# EAGLE design Robot_Psoc_Caras_2 (EAGLE 7.5.0)
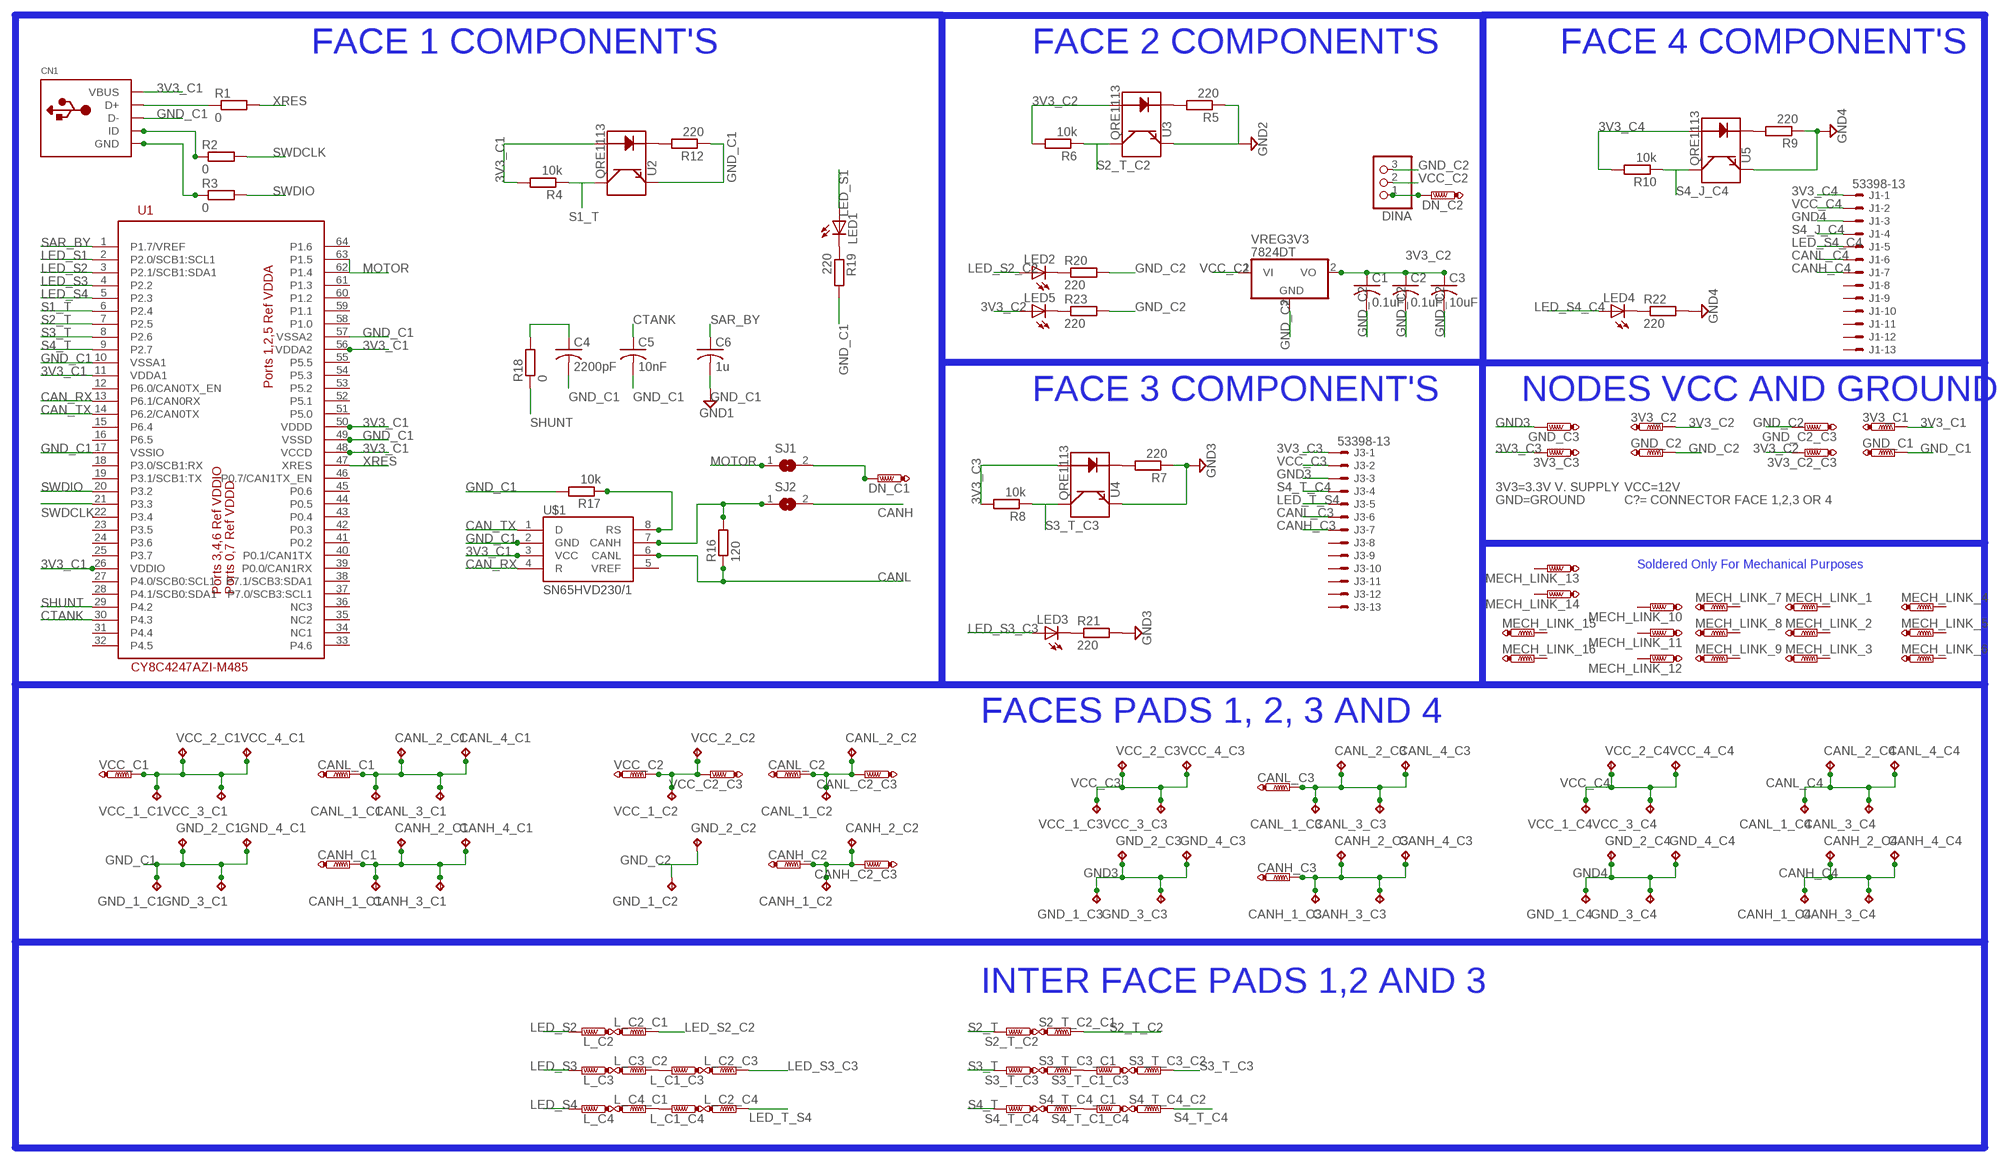
[diagram p0: schematic, sheet 1]

## Parts
3V3_C1  PTR1TP11R  [TP11R]
3V3_C2  PTR1TP11R  [TP11R]
3V3_C2_C3  PTR1TP11R  [TP11R]
3V3_C3  PTR1TP11R  [TP11R]
C1  0.1uF  C-USC0805  [C0805]
C2  0.1uF  C-USC0805  [C0805]
C3  10uF  C-USC4532  [C4532]
C4  2200pF  C-USC0805  [C0805]
C5  10nF  C-USC0805  [C0805]
C6  1u  C-USC0805  [C0805]
CANH_1_C1  TPB2,54  [B2,54]
CANH_1_C2  TPB2,54  [B2,54]
CANH_1_C3  TPB2,54  [B2,54]
CANH_1_C4  TPB2,54  [B2,54]
CANH_2_C1  TPB2,54  [B2,54]
CANH_2_C2  TPB2,54  [B2,54]
CANH_2_C3  TPB2,54  [B2,54]
CANH_2_C4  TPB2,54  [B2,54]
CANH_3_C1  TPB2,54  [B2,54]
CANH_3_C3  TPB2,54  [B2,54]
CANH_3_C4  TPB2,54  [B2,54]
CANH_4_C1  TPB2,54  [B2,54]
CANH_4_C3  TPB2,54  [B2,54]
CANH_4_C4  TPB2,54  [B2,54]
CANH_C1  PTR1TP11R  [TP11R]
CANH_C2  PTR1TP11R  [TP11R]
CANH_C2_C3  PTR1TP11R  [TP11R]
CANH_C3  PTR1TP11R  [TP11R]
CANL_1_C1  TPB2,54  [B2,54]
CANL_1_C2  TPB2,54  [B2,54]
CANL_1_C3  TPB2,54  [B2,54]
CANL_1_C4  TPB2,54  [B2,54]
CANL_2_C1  TPB2,54  [B2,54]
CANL_2_C2  TPB2,54  [B2,54]
CANL_2_C3  TPB2,54  [B2,54]
CANL_2_C4  TPB2,54  [B2,54]
CANL_3_C1  TPB2,54  [B2,54]
CANL_3_C3  TPB2,54  [B2,54]
CANL_3_C4  TPB2,54  [B2,54]
CANL_4_C1  TPB2,54  [B2,54]
CANL_4_C3  TPB2,54  [B2,54]
CANL_4_C4  TPB2,54  [B2,54]
CANL_C1  PTR1TP11R  [TP11R]
CANL_C2  PTR1TP11R  [TP11R]
CANL_C2_C3  PTR1TP11R  [TP11R]
CANL_C3  PTR1TP11R  [TP11R]
CN1  USBMINIB  [USB-MINIB]
DINA  PINHD-1X3  [1X03]
DN_C1  PTR1TP11R  [TP11R]
DN_C2  PTR1TP11R  [TP11R]
GND_1_C1  TPB2,54  [B2,54]
GND_1_C2  TPB2,54  [B2,54]
GND_1_C3  TPB2,54  [B2,54]
GND_1_C4  TPB2,54  [B2,54]
GND_2_C1  TPB2,54  [B2,54]
GND_2_C2  TPB2,54  [B2,54]
GND_2_C3  TPB2,54  [B2,54]
GND_2_C4  TPB2,54  [B2,54]
GND_3_C1  TPB2,54  [B2,54]
GND_3_C3  TPB2,54  [B2,54]
GND_3_C4  TPB2,54  [B2,54]
GND_4_C1  TPB2,54  [B2,54]
GND_4_C3  TPB2,54  [B2,54]
GND_4_C4  TPB2,54  [B2,54]
GND_C1  PTR1TP11R  [TP11R]
GND_C2  PTR1TP11R  [TP11R]
GND_C2_C3  PTR1TP11R  [TP11R]
GND_C3  PTR1TP11R  [TP11R]
J1  53398-13  [53398-13]
J3  53398-13  [53398-13]
L_C1_C3  PTR1TP11R  [TP11R]
L_C1_C4  PTR1TP11R  [TP11R]
L_C2  PTR1TP11R  [TP11R]
L_C2_C1  PTR1TP11R  [TP11R]
L_C2_C3  PTR1TP11R  [TP11R]
L_C2_C4  PTR1TP11R  [TP11R]
L_C3  PTR1TP11R  [TP11R]
L_C3_C2  PTR1TP11R  [TP11R]
L_C4  PTR1TP11R  [TP11R]
L_C4_C1  PTR1TP11R  [TP11R]
LED1  LEDCHIPLED_0805  [CHIPLED_0805]
LED2  LEDCHIPLED_0805  [CHIPLED_0805]
LED3  LEDCHIPLED_0805  [CHIPLED_0805]
LED4  LEDCHIPLED_0805  [CHIPLED_0805]
LED5  LEDCHIPLED_0805  [CHIPLED_0805]
MECH_LINK_1  PTR1TP11R  [TP11R]
MECH_LINK_2  PTR1TP11R  [TP11R]
MECH_LINK_3  PTR1TP11R  [TP11R]
MECH_LINK_4  PTR1TP11R  [TP11R]
MECH_LINK_5  PTR1TP11R  [TP11R]
MECH_LINK_6  PTR1TP11R  [TP11R]
MECH_LINK_7  PTR1TP11R  [TP11R]
MECH_LINK_8  PTR1TP11R  [TP11R]
MECH_LINK_9  PTR1TP11R  [TP11R]
MECH_LINK_10  PTR1TP11R  [TP11R]
MECH_LINK_11  PTR1TP11R  [TP11R]
MECH_LINK_12  PTR1TP11R  [TP11R]
MECH_LINK_13  PTR1TP11R  [TP11R]
MECH_LINK_14  PTR1TP11R  [TP11R]
MECH_LINK_15  PTR1TP11R  [TP11R]
MECH_LINK_16  PTR1TP11R  [TP11R]
R1  0  R-EU_R0805  [R0805]
R2  0  R-EU_R0805  [R0805]
R3  0  R-EU_R0805  [R0805]
R4  10k  R-EU_R0805  [R0805]
R5  220  R-EU_R0805  [R0805]
R6  10k  R-EU_R0805  [R0805]
R7  220  R-EU_R0805  [R0805]
R8  10k  R-EU_R0805  [R0805]
R9  220  R-EU_R0805  [R0805]
R10  10k  R-EU_R0805  [R0805]
R12  220  R-EU_R0805  [R0805]
R16  120  R-EU_R0805  [R0805]
R17  10k  R-EU_R0805  [R0805]
R18  0  R-EU_R0805  [R0805]
R19  220  R-EU_R0805  [R0805]
R20  220  R-EU_R0805  [R0805]
R21  220  R-EU_R0805  [R0805]
R22  220  R-EU_R0805  [R0805]
R23  220  R-EU_R0805  [R0805]
S2_T_C2  PTR1TP11R  [TP11R]
S2_T_C2_C1  PTR1TP11R  [TP11R]
S3_T_C1_C3  PTR1TP11R  [TP11R]
S3_T_C3  PTR1TP11R  [TP11R]
S3_T_C3_C1  PTR1TP11R  [TP11R]
S3_T_C3_C2  PTR1TP11R  [TP11R]
S4_T_C1_C4  PTR1TP11R  [TP11R]
S4_T_C4  PTR1TP11R  [TP11R]
S4_T_C4_C1  PTR1TP11R  [TP11R]
S4_T_C4_C2  PTR1TP11R  [TP11R]
SJ1  SJ  [SJ]
SJ2  SJ  [SJ]
U1  CY8C4247AZI-M485  [TQFP64-10X10]
U2  QRE1113  [QRE1113]
U3  QRE1113  [QRE1113]
U4  QRE1113  [QRE1113]
U5  QRE1113  [QRE1113]
U$1  SN65HVD230/1  [SO8]
VCC_1_C1  TPB2,54  [B2,54]
VCC_1_C2  TPB2,54  [B2,54]
VCC_1_C3  TPB2,54  [B2,54]
VCC_1_C4  TPB2,54  [B2,54]
VCC_2_C1  TPB2,54  [B2,54]
VCC_2_C2  TPB2,54  [B2,54]
VCC_2_C3  TPB2,54  [B2,54]
VCC_2_C4  TPB2,54  [B2,54]
VCC_3_C1  TPB2,54  [B2,54]
VCC_3_C3  TPB2,54  [B2,54]
VCC_3_C4  TPB2,54  [B2,54]
VCC_4_C1  TPB2,54  [B2,54]
VCC_4_C3  TPB2,54  [B2,54]
VCC_4_C4  TPB2,54  [B2,54]
VCC_C1  PTR1TP11R  [TP11R]
VCC_C2  PTR1TP11R  [TP11R]
VCC_C2_C3  PTR1TP11R  [TP11R]
VREG3V3  7824DT  [TO252]

## Nets
3V3_C1: 3V3_C1.TP CN1.VBUS R4.2 U1.11(VDDA1) U1.26(VDDIO) U1.48(VCCD) U1.50(VDDD) U1.56(VDDA2) U2.1(A) U$1.3(VCC)
3V3_C2: 3V3_C2.TP 3V3_C2_C3.TP C1.1 C2.1 C3.1 LED5.A R6.2 U3.1(A) VREG3V3.2(VO)
3V3_C3: 3V3_C3.TP J3.1 R8.2 U4.1(A)
3V3_C4: J1.1 R10.2 U5.1(A)
CAN_RX: U1.13(P6.1/CAN0RX) U$1.4(R)
CAN_TX: U1.14(P6.2/CAN0TX) U$1.1(D)
CANH: CANH_1_C1.TP CANH_2_C1.TP CANH_3_C1.TP CANH_4_C1.TP CANH_C1.TP SJ2.2
CANH_C3: CANH_1_C3.TP CANH_2_C3.TP CANH_3_C3.TP CANH_4_C3.TP CANH_C3.TP J3.7
CANH_C4: CANH_1_C4.TP CANH_2_C4.TP CANH_3_C4.TP CANH_4_C4.TP J1.7
CANL: CANL_1_C1.TP CANL_2_C1.TP CANL_3_C1.TP CANL_4_C1.TP CANL_C1.TP R16.1 U$1.6(CANL)
CANL_C3: CANL_1_C3.TP CANL_2_C3.TP CANL_3_C3.TP CANL_4_C3.TP CANL_C3.TP J3.6
CANL_C4: CANL_1_C4.TP CANL_2_C4.TP CANL_3_C4.TP CANL_4_C4.TP J1.6
CTANK: C5.1 U1.30(P4.3)
GND3: GND_1_C3.TP GND_2_C3.TP GND_3_C3.TP GND_4_C3.TP GND_C3.TP J3.3 R7.1 R21.2 U4.4(E)
GND4: GND_1_C4.TP GND_2_C4.TP GND_3_C4.TP GND_4_C4.TP J1.3 R9.1 R22.2 U5.4(E)
GND_C1: C4.2 C5.2 C6.2 CN1.D- GND_1_C1.TP GND_2_C1.TP GND_3_C1.TP GND_4_C1.TP GND_C1.TP R12.1 R17.2 R19.2 U1.10(VSSA1) U1.17(VSSIO) U1.49(VSSD) U1.57(VSSA2) U2.4(E) U$1.2(GND) ; supply symbol labelled GND1
GND_C2: C1.2 C2.2 C3.2 DINA.3 GND_1_C2.TP GND_2_C2.TP GND_C2.TP GND_C2_C3.TP R5.1 R20.2 R23.2 U3.4(E) VREG3V3.3(GND) ; supply symbol labelled GND2
LED_S1: LED1.A U1.2(P2.0/SCB1:SCL1)
LED_S2: L_C2.TP U1.3(P2.1/SCB1:SDA1)
LED_S2_C2: L_C2_C1.TP LED2.A
LED_S3: L_C3.TP U1.4(P2.2)
LED_S3_C3: L_C2_C3.TP LED3.A
LED_S4: L_C4.TP U1.5(P2.3)
LED_S4_C4: J1.5 LED4.A
LED_T_S4: J3.5 L_C2_C4.TP
MOTOR: SJ1.1 U1.62(P1.4) U1.63(P1.5)
N$1: CN1.D+ R1.1
N$2: CN1.ID R2.1
N$3: CN1.GND R3.1
N$5: R16.2 SJ2.1 U$1.7(CANH)
N$6: R5.2 U3.2(K)
N$7: CANH_1_C2.TP CANH_2_C2.TP CANH_C2.TP CANH_C2_C3.TP
N$8: R7.2 U4.2(K)
N$9: R17.1 U$1.8(RS)
N$10: R9.2 U5.2(K)
N$11: C4.1 R18.2
N$13: DN_C1.TP SJ1.2
N$14: LED1.C R19.1
N$15: LED2.C R20.1
N$16: LED3.C R21.1
N$17: LED4.C R22.1
N$18: LED5.C R23.1
N$19: DINA.1 DN_C2.TP
N$20: L_C1_C4.TP L_C4_C1.TP
N$21: R12.2 U2.2(K)
N$22: L_C1_C3.TP L_C3_C2.TP
N$26: S3_T_C1_C3.TP S3_T_C3_C1.TP
N$27: S4_T_C1_C4.TP S4_T_C4_C1.TP
N$29: VCC_1_C1.TP VCC_2_C1.TP VCC_3_C1.TP VCC_4_C1.TP VCC_C1.TP
N$32: CANL_1_C2.TP CANL_2_C2.TP CANL_C2.TP CANL_C2_C3.TP
S1_T: R4.1 U1.6(P2.4) U2.3(C)
S2_T: S2_T_C2.TP U1.7(P2.5)
S2_T_C2: R6.1 S2_T_C2_C1.TP U3.3(C)
S3_T: S3_T_C3.TP U1.8(P2.6)
S3_T_C3: R8.1 S3_T_C3_C2.TP U4.3(C)
S4_J_C4: J1.4 R10.1 U5.3(C)
S4_T: S4_T_C4.TP U1.9(P2.7)
S4_T_C4: J3.4 S4_T_C4_C2.TP
SAR_BY: C6.1 U1.1(P1.7/VREF)
SHUNT: R18.1 U1.29(P4.2)
SWDCLK: R2.2 U1.21(P3.3)
SWDIO: R3.2 U1.20(P3.2)
VCC_C2: DINA.2 VCC_1_C2.TP VCC_2_C2.TP VCC_C2.TP VCC_C2_C3.TP VREG3V3.1(VI)
VCC_C3: J3.2 VCC_1_C3.TP VCC_2_C3.TP VCC_3_C3.TP VCC_4_C3.TP
VCC_C4: J1.2 VCC_1_C4.TP VCC_2_C4.TP VCC_3_C4.TP VCC_4_C4.TP
XRES: R1.2 U1.47(XRES)
Unconnected: J1.8 J1.9 J1.10 J1.11 J1.12 J1.13 J3.8 J3.9 J3.10 J3.11 J3.12 J3.13 MECH_LINK_1.TP MECH_LINK_2.TP MECH_LINK_3.TP MECH_LINK_4.TP MECH_LINK_5.TP MECH_LINK_6.TP MECH_LINK_7.TP MECH_LINK_8.TP MECH_LINK_9.TP MECH_LINK_10.TP MECH_LINK_11.TP MECH_LINK_12.TP MECH_LINK_13.TP MECH_LINK_14.TP MECH_LINK_15.TP MECH_LINK_16.TP U1.12(P6.0/CAN0TX_EN) U1.15(P6.4) U1.16(P6.5) U1.18(P3.0/SCB1:RX) U1.19(P3.1/SCB1:TX) U1.22(P3.4) U1.23(P3.5) U1.24(P3.6) U1.25(P3.7) U1.27(P4.0/SCB0:SCL1) U1.28(P4.1/SCB0:SDA1) U1.31(P4.4) U1.32(P4.5) U1.33(P4.6) U1.34(NC1) U1.35(NC2) U1.36(NC3) U1.37(P7.0/SCB3:SCL1) U1.38(P7.1/SCB3:SDA1) U1.39(P0.0/CAN1RX) U1.40(P0.1/CAN1TX) U1.41(P0.2) U1.42(P0.3) U1.43(P0.4) U1.44(P0.5) U1.45(P0.6) U1.46(P0.7/CAN1TX_EN) U1.51(P5.0) U1.52(P5.1) U1.53(P5.2) U1.54(P5.3) U1.55(P5.5) U1.58(P1.0) U1.59(P1.1) U1.60(P1.2) U1.61(P1.3) U1.64(P1.6) U$1.5(VREF)

## Notes on the sheet
- FACE 1 COMPONENT'S | FACE 2 COMPONENT'S | FACE 4 COMPONENT'S
- FACE 3 COMPONENT'S | NODES VCC AND GROUND
- 3V3=3.3V V. SUPPLY | VCC=12V
- GND=GROUND | C?= CONNECTOR FACE 1,2,3 OR 4
- Soldered Only For Mechanical Purposes
- FACES PADS 1, 2, 3 AND 4
- INTER FACE PADS 1,2 AND 3

## Library data of the parts
3V3_C1 3V3_C2 3V3_C2_C3 3V3_C3 CANH_C1 CANH_C2 CANH_C2_C3 CANH_C3 CANL_C1 CANL_C2 CANL_C2_C3 CANL_C3 DN_C1 DN_C2 GND_C1 GND_C2 GND_C2_C3 GND_C3 L_C1_C3 L_C1_C4 L_C2 L_C2_C1 L_C2_C3 L_C2_C4 L_C3 L_C3_C2 L_C4 L_C4_C1 MECH_LINK_1-MECH_LINK_16 S2_T_C2 S2_T_C2_C1 S3_T_C1_C3 S3_T_C3 S3_T_C3_C1 S3_T_C3_C2 S4_T_C1_C4 S4_T_C4 S4_T_C4_C1 S4_T_C4_C2 VCC_C1 VCC_C2 VCC_C2_C3 = testpad:PTR1: TEST PIN
C1-C6 = rcl:C-US: CAPACITOR, American symbol
CANH_1_C1-CANH_1_C4 CANH_2_C1-CANH_2_C4 CANH_3_C1 CANH_3_C3 CANH_3_C4 CANH_4_C1 CANH_4_C3 CANH_4_C4 CANL_1_C1-CANL_1_C4 CANL_2_C1-CANL_2_C4 CANL_3_C1 CANL_3_C3 CANL_3_C4 CANL_4_C1 CANL_4_C3 CANL_4_C4 GND_1_C1-GND_1_C4 GND_2_C1-GND_2_C4 GND_3_C1 GND_3_C3 GND_3_C4 GND_4_C1 GND_4_C3 GND_4_C4 VCC_1_C1-VCC_1_C4 VCC_2_C1-VCC_2_C4 VCC_3_C1 VCC_3_C3 VCC_3_C4 VCC_4_C1 VCC_4_C3 VCC_4_C4 = testpad:TP: Test pad
CN1 = adafruit:USB: USB Connectors USBMINIB - Surface Mount Female Mini-B USB Connector 4UConnector: 06564 By microbuilder.eu Thru-hole RA Female Mini-B USB Connector 4UConnector: 18732 By ladyada.net
DINA = pinhead:PINHD-1X3: PIN HEADER
J1 J3 = con-molex:53?-13: CONNECTOR wire to board 1.25 mm (.049 inch) pitch header; OC_FARNELL: unknown; OC_NEWARK: unknown
LED1-LED5 = adafruit:LED: LED OSRAM: - CHIPLED LG R971, LG N971, LY N971, LG Q971, LY Q971, LO R971, LY R971 LH N974, LH R974 LS Q976, LO Q976, LY Q976 LO Q996 - Hyper CHIPLED LW Q18S LB Q993, LB Q99A, LB R99A - SideLED LS A670, LO A670, LY A670, LG A670, LP A670 LB A673, LV A673, LT A673, LW A673 LH A674 LY A675 LS A676, LA A676, LO A676, LY A676, LW A676 LS A679, LY A679, LG A679 - Hyper Micro SIDELED® LS Y876, LA Y876, LO Y876, LY Y876 LT Y87S - SmartLED LW L88C, LW L88S LB L89C, LB L89S, LG L890 LS L89K, LO L89K, LY L89K LS L896, LA L896, LO L896, LY L896 - TOPLED LS T670, LO T670, LY T670, LG T670, LP T670 LSG T670, LSP T670, LSY T670, LOP T670, LYG T670 LG T671, LOG T671, LSG T671 LB T673, LV T673, LT T673, LW T673 LH T674 LS T676, LA T676, LO T676, LY T676, LB T676, LH T676, LSB T676, LW T676 LB T67C, LV T67C, LT T67C, LS T67K, LO T67K, LY T67K, LW E67C LS E67B, LA E67B, LO E67B, LY E67B, LB E67C, LV E67C, LT E67C LW T67C LS T679, LY T679, LG T679 LS T770, LO T770, LY T770, LG T770, LP T770 LB T773, LV T773, LT T773, LW T773 LH T774 LS E675, LA E675, LY E675, LS T675 LS T776, LA T776, LO T776, LY T776, LB T776 LHGB T686 LT T68C, LB T68C - Hyper Mini TOPLED® LB M676 - Mini TOPLED Santana® LG M470 LS M47K, LO M47K, LY M47K Source: http://www.osram.convergy.de/
R1-R10 R12 R16-R23 = rcl:R-EU_: RESISTOR, European symbol
SJ1 SJ2 = jumper:SJ: SMD solder JUMPER
U1 = CypressPSoC:CY8C4247AZI-M485
U2-U5 = SparkFun-Sensors:QRE1113: Reflective object sensor; PROD_ID: IC-09357
U$1 = texas_instruments:SN65HVD230/1
VREG3V3 = adafruit:78*: Positive VOLTAGE REGULATOR Added bigger pads to the TO-92 package

## Board
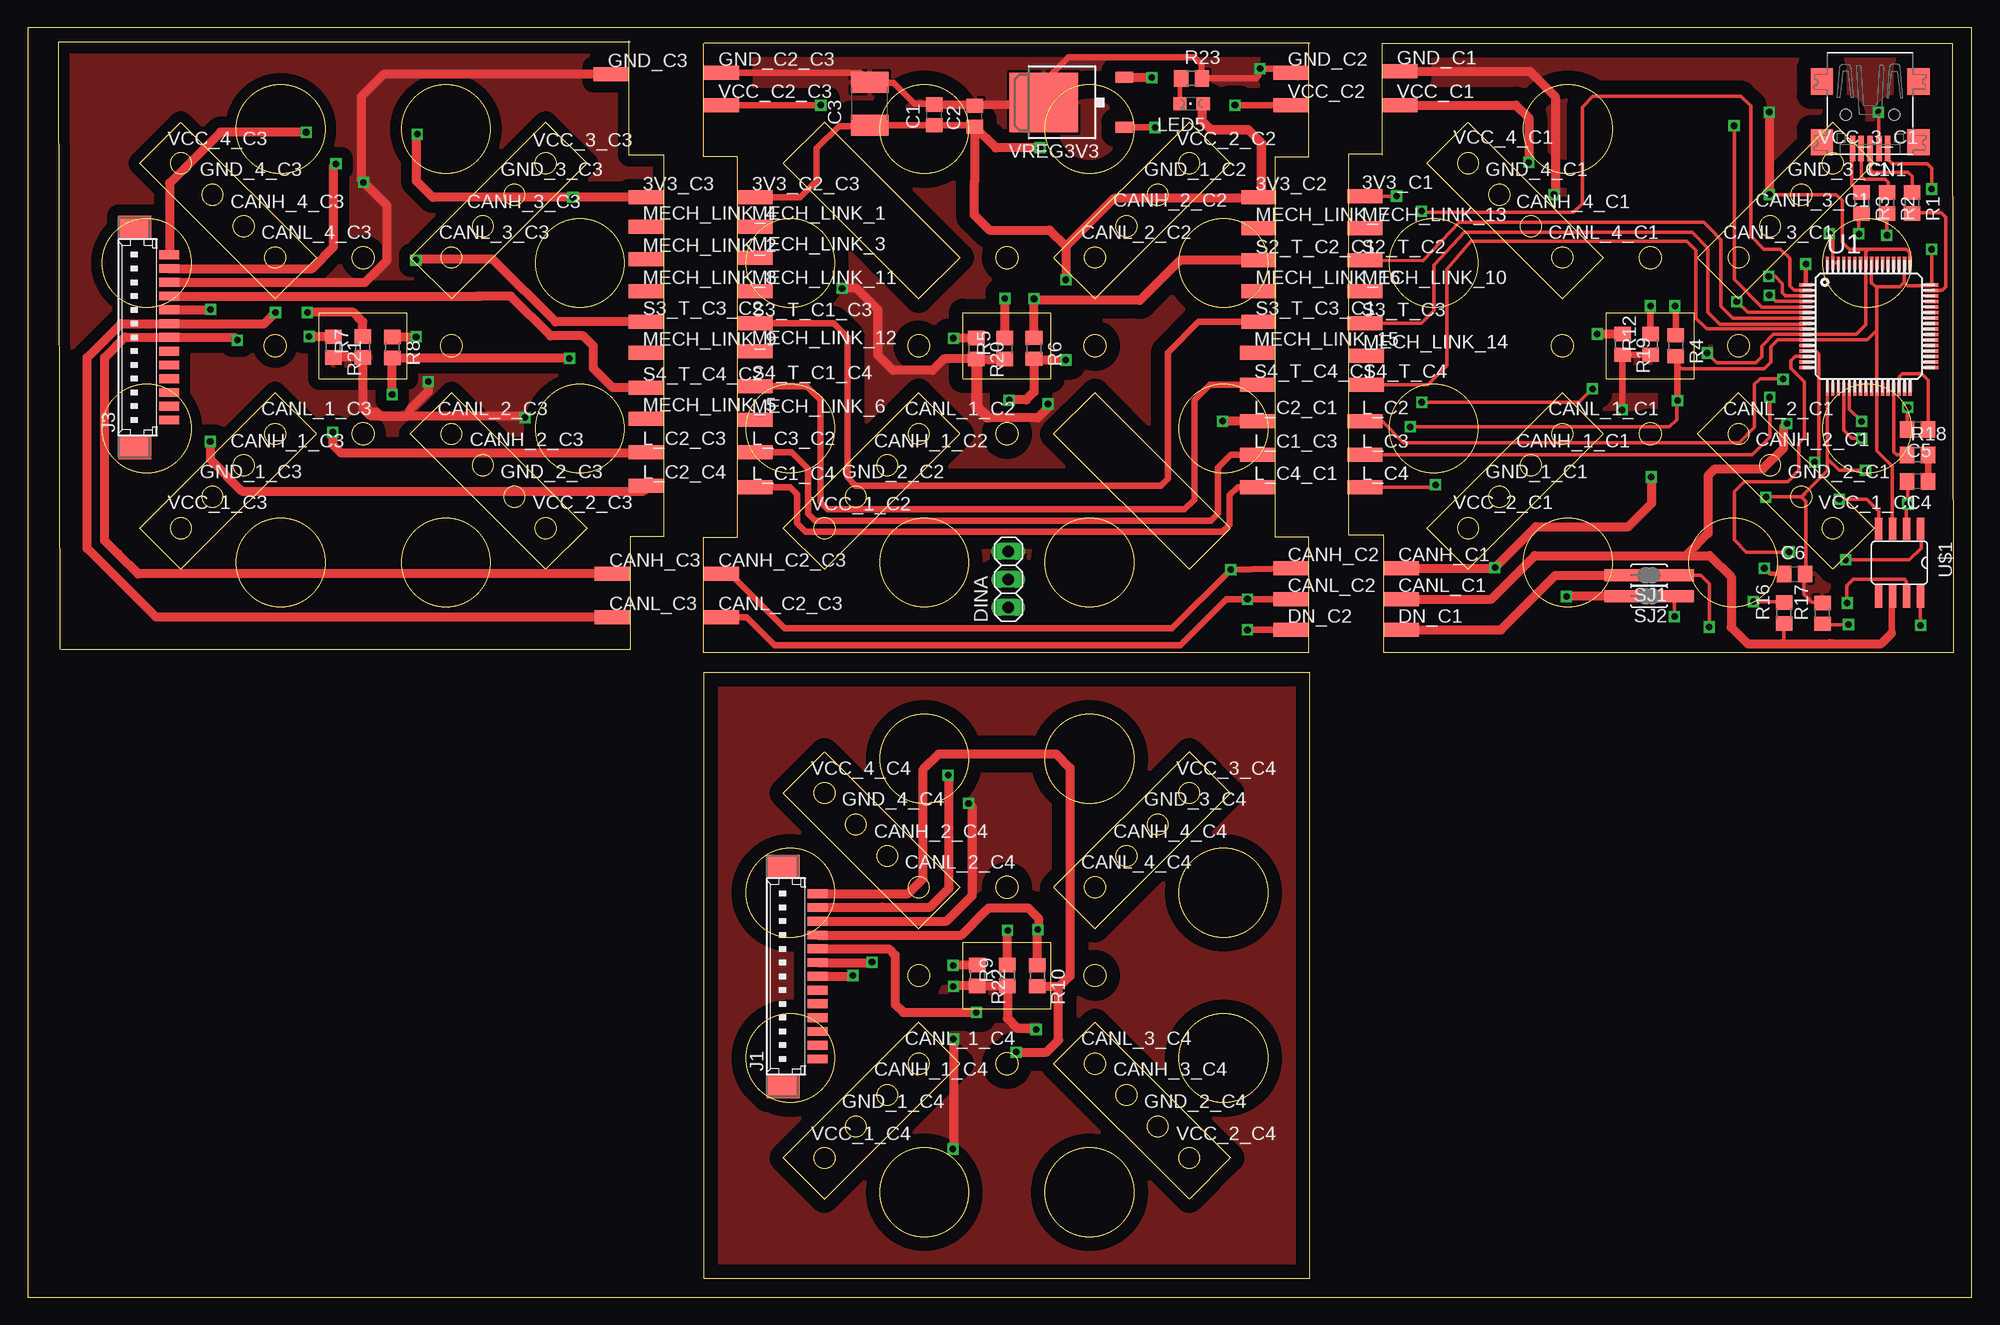
[diagram p1: board, top side]
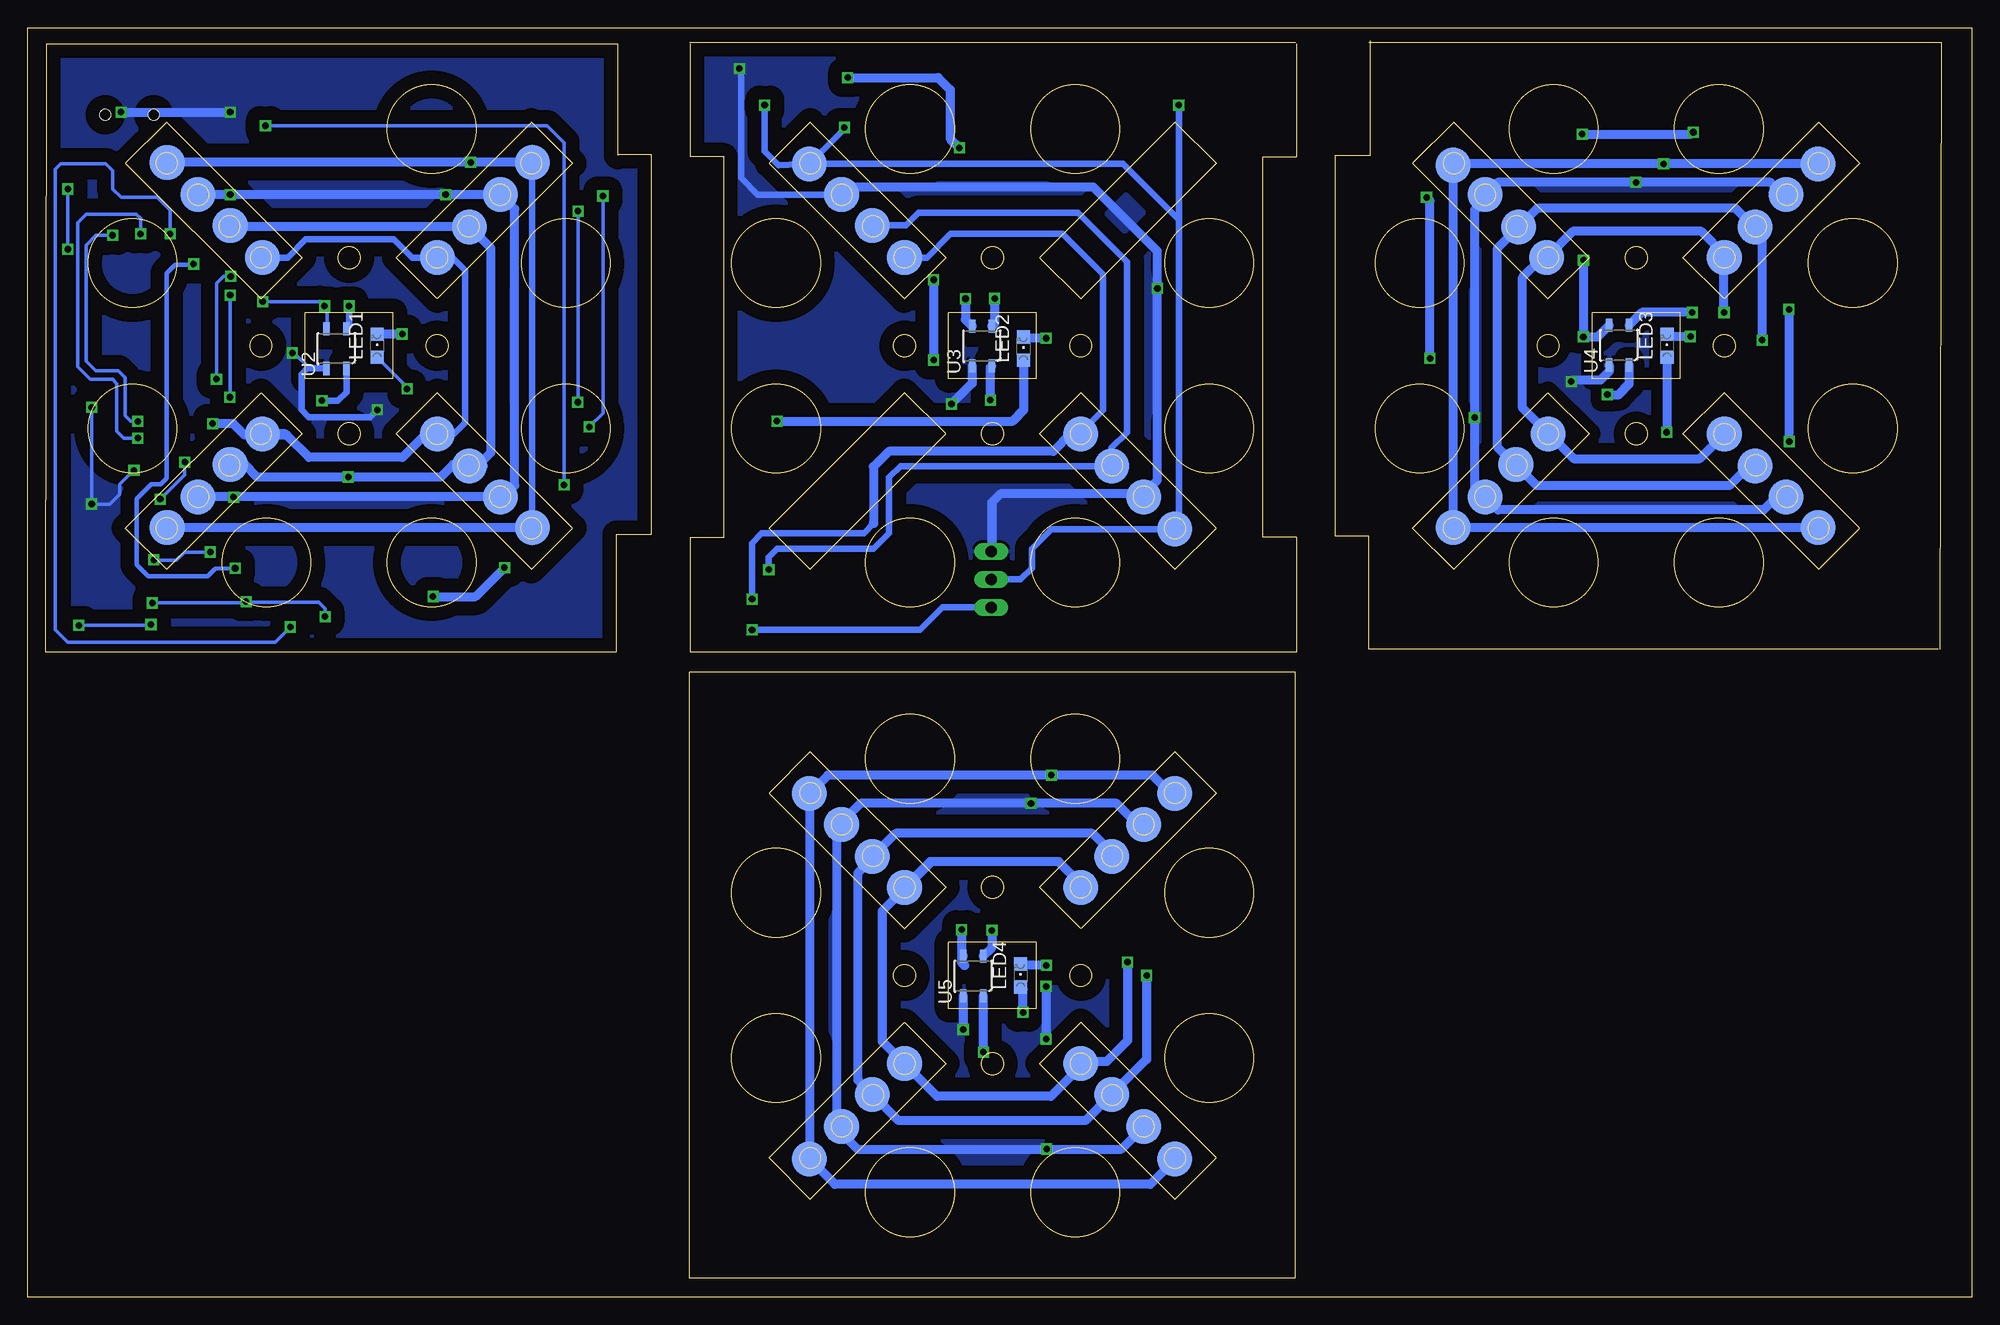
[diagram p2: board, bottom side, seen from below]

Size 176.51 x 115.24 mm. Coordinates in mm from the lower left corner, seen from the top.
Outline: 61.4,113.86 116.4,113.86
Outline: 54.61,114.05 54.61,103.63 57.78,103.63 57.78,69.09 54.74,69.09 54.74,58.8 3.05,58.8
Outline: 54.74,113.92 2.79,113.92 2.92,58.8
Outline: 116.33,113.79 116.33,103.5 113.28,103.5 113.28,68.96 116.33,68.96 116.33,58.55 61.34,58.55 61.34,68.96 64.39,68.96 64.39,103.5 61.34,103.5 61.34,113.79
Outline: 122.94,103.76 119.89,103.76 119.89,69.22 123.06,69.22 123.06,58.55 174.88,58.55 174.75,113.79 122.94,113.79 122.94,103.63
Outline: 0,0 176.51,0 176.51,115.24 0,115.24 0,0
Outline: 72.34,66.06 84.65,78.36 80.9,82.11 68.6,69.8 72.34,66.06
Outline: 109.2,69.8 96.9,82.11 93.15,78.36 105.46,66.06 109.2,69.8
Outline: 72.34,106.66 68.6,102.92 80.9,90.61 84.65,94.36 72.34,106.66
Outline: 93.15,94.36 96.9,90.61 109.2,102.92 105.46,106.66 93.15,94.36
Outline: 92.9,83.36 92.9,89.36 84.9,89.36 84.9,83.36 92.9,83.36
Outline: 72.34,8.91 84.65,21.21 80.9,24.96 68.6,12.65 72.34,8.91
Outline: 93.15,37.21 96.9,33.46 109.2,45.77 105.46,49.51 93.15,37.21
Outline: 61.4,1.71 61.4,56.71 116.4,56.71 116.4,1.71 61.4,1.71
Outline: 92.9,26.21 92.9,32.21 84.9,32.21 84.9,26.21 92.9,26.21
Outline: 80.9,33.46 84.65,37.21 72.34,49.51 68.6,45.77 80.9,33.46
Outline: 96.9,24.96 93.15,21.21 105.46,8.91 109.2,12.65 96.9,24.96
Outline: 13.92,66.06 26.23,78.36 22.48,82.11 10.18,69.8 13.92,66.06
Outline: 34.73,94.36 38.48,90.61 50.78,102.92 47.04,106.66 34.73,94.36
Outline: 34.48,83.36 34.48,89.36 26.48,89.36 26.48,83.36 34.48,83.36
Outline: 22.48,90.61 26.23,94.36 13.92,106.66 10.18,102.92 22.48,90.61
Outline: 38.48,82.11 34.73,78.36 47.04,66.06 50.78,69.8 38.48,82.11
Outline: 130.76,66.06 143.07,78.36 139.32,82.11 127.02,69.8 130.76,66.06
Outline: 151.57,94.36 155.32,90.61 167.62,102.92 163.88,106.66 151.57,94.36
Outline: 151.32,83.36 151.32,89.36 143.32,89.36 143.32,83.36 151.32,83.36
Outline: 139.32,90.61 143.07,94.36 130.76,106.66 127.02,102.92 139.32,90.61
Outline: 155.32,82.11 151.57,78.36 163.88,66.06 167.62,69.8 155.32,82.11
Outline: circle at 69.23,78.86 radius 4.04
Outline: circle at 69.23,93.86 radius 4.04
Outline: circle at 96.4,66.69 radius 4.04
Outline: circle at 72.34,69.8 radius 0.95
Outline: circle at 75.2,72.66 radius 0.95
Outline: circle at 78.05,75.51 radius 0.95
Outline: circle at 72.34,69.8 radius 0.95
Outline: circle at 78.05,75.51 radius 0.95
Outline: circle at 75.2,72.66 radius 0.95
Outline: circle at 99.75,97.21 radius 0.95
Outline: circle at 102.6,100.06 radius 0.95
Outline: circle at 105.46,102.92 radius 0.95
Outline: circle at 105.46,102.92 radius 0.95
Outline: circle at 102.6,100.06 radius 0.95
Outline: circle at 108.57,93.86 radius 4.04
Outline: circle at 80.9,86.36 radius 1
Outline: circle at 80.9,78.36 radius 0.95
Outline: circle at 99.75,97.21 radius 0.95
Outline: circle at 88.9,94.36 radius 1
Outline: circle at 96.9,94.36 radius 0.95
Copper layers (1*16): Top 0.035mm / dielectric 1.5mm / Bottom 0.035mm
Design rules "default": minimum track width 10mil, minimum drill 24mil, track to track 8mil, track to pad 8mil, pad to pad 8mil, via to via 8mil, smd to smd 8mil, copper to edge 40mil, drill to drill 8mil, minimum pad ring 10mil, minimum via ring 8mil, stop-mask expansion 4mil, vias tented up to drill 0mil, thermal gap 10mil

### Footprints (pad centres in the part's own frame; a part is rotated, then mirrored left to right if it is on the bottom)
TP11R = smd 0.635 x 1.27: P$1 0.381,0; P$2 1.016,0; P$3 -0.254,0; P$4 -0.889,0; P$5 -1.524,0 | smd 1.1 x 1.1: TP 0,0
C0805 = smd 1.3 x 1.5: 1 -0.95,0; 2 0.95,0
C4532 = smd 1.9 x 3.4: 1 -1.95,0; 2 1.95,0
B2,54 = smd 3.175 x 3.175 bottom: P$1 0,0 | smd 2.54 x 2.54 bottom: TP 0,0
USB-MINIB = smd 0.5 x 2.308: D+ 0,4.064; D- -0.8,4.064; GND 1.6,4.064; ID 0.8,4.064; VBUS -1.6,4.064 | smd 2 x 2.4: GND1 -4.4,-2; GND2 -4.4,3.5; GND3 4.4,3.5; GND4 4.4,-2 | hole 1: -2.2,1; 2.2,1
1X03 = drill 1.016 long: 1 -2.54,0; 2 0,0; 3 2.54,0
53398-13 = smd 0.8 x 1.8: 1 7.5,-2.5; 2 6.25,-2.5; 3 5,-2.5; 4 3.75,-2.5; 5 2.5,-2.5; 6 1.25,-2.5; 7 0,-2.5; 8 -1.25,-2.5; 9 -2.5,-2.5; 10 -3.75,-2.5; 11 -5,-2.5; 12 -6.25,-2.5; 13 -7.5,-2.5 | smd 2.1 x 3: S1 10,0.625; S2 -10,0.625
CHIPLED_0805 = smd 1.2 x 1.2: A 0,-1.05; C 0,1.05
R0805 = smd 1.3 x 1.5: 1 -0.95,0; 2 0.95,0
SJ = smd 3.556 x 1.067: 1 -2.286,0; 2 2.286,0
TQFP64-10X10 = smd 1.2 x 0.3: 1 -5.7,3.75; 2 -5.7,3.25; 3 -5.7,2.75; 4 -5.7,2.25; 5 -5.7,1.75; 6 -5.7,1.25; 7 -5.7,0.75; 8 -5.7,0.25; 9 -5.7,-0.25; 10 -5.7,-0.75; 11 -5.7,-1.25; 12 -5.7,-1.75; 13 -5.7,-2.25; 14 -5.7,-2.75; 15 -5.7,-3.25; 16 -5.7,-3.75; 33 5.7,-3.75; 34 5.7,-3.25; 35 5.7,-2.75; 36 5.7,-2.25; 37 5.7,-1.75; 38 5.7,-1.25; 39 5.7,-0.75; 40 5.7,-0.25; 41 5.7,0.25; 42 5.7,0.75; 43 5.7,1.25; 44 5.7,1.75; 45 5.7,2.25; 46 5.7,2.75; 47 5.7,3.25; 48 5.7,3.75 | smd 0.3 x 1.2: 17 -3.75,-5.7; 18 -3.25,-5.7; 19 -2.75,-5.7; 20 -2.25,-5.7; 21 -1.75,-5.7; 22 -1.25,-5.7; 23 -0.75,-5.7; 24 -0.25,-5.7; 25 0.25,-5.7; 26 0.75,-5.7; 27 1.25,-5.7; 28 1.75,-5.7; 29 2.25,-5.7; 30 2.75,-5.7; 31 3.25,-5.7; 32 3.75,-5.7; 49 3.75,5.7; 50 3.25,5.7; 51 2.75,5.7; 52 2.25,5.7; 53 1.75,5.7; 54 1.25,5.7; 55 0.75,5.7; 56 0.25,5.7; 57 -0.25,5.7; 58 -0.75,5.7; 59 -1.25,5.7; 60 -1.75,5.7; 61 -2.25,5.7; 62 -2.75,5.7; 63 -3.25,5.7; 64 -3.75,5.7
QRE1113 = smd 1.2 x 0.6: 1 -1.8,-0.9; 2 1.8,-0.9; 3 1.8,0.9; 4 -1.8,0.9
SO8 = smd 0.66 x 2.032: 1 -1.905,-3.073; 2 -0.635,-3.073; 3 0.635,-3.073; 4 1.905,-3.073; 5 1.905,3.073; 6 0.635,3.073; 7 -0.635,3.073; 8 -1.905,3.073
TO252 = smd 1 x 1.6: 1 -2.28,-4.8; 2 2.28,-4.8 | smd 5.4 x 6.2: 3 0,2.5

### Placement (x,y rotation side)
3V3_C1  121.67,99.95 0 top
3V3_C2  112.01,99.82 0 top
3V3_C2_C3  66.29,99.82 0 top
3V3_C3  56.39,99.82 0 top
C1  82.3,107.31 90 top
C2  85.98,107.19 90 top
C3  76.45,108.33 90 top
C4  171.58,74.04 180 top
C5  171.58,78.74 180 top
C6  160.4,65.66 0 top
CANH_1_C1  136.4,75.44 0 top
CANH_1_C2  78.11,75.44 0 top
CANH_1_C3  19.68,75.44 0 top
CANH_1_C4  78.11,18.41 0 top
CANH_2_C1  158.12,75.56 0 top
CANH_2_C2  99.82,97.28 0 top
CANH_2_C3  41.4,75.56 0 top
CANH_2_C4  78.11,40.01 0 top
CANH_3_C1  158.12,97.28 0 top
CANH_3_C3  41.15,97.16 0 top
CANH_3_C4  99.82,18.41 0 top
CANH_4_C1  136.4,97.16 0 top
CANH_4_C3  19.68,97.16 0 top
CANH_4_C4  99.82,40.01 0 top
CANH_C1  124.97,66.17 0 top
CANH_C2  114.94,66.17 0 top
CANH_C2_C3  63.25,65.66 0 top
CANH_C3  53.34,65.66 0 top
CANL_1_C1  139.32,78.36 0 top
CANL_1_C2  80.9,78.36 0 top
CANL_1_C3  22.48,78.36 0 top
CANL_1_C4  80.9,21.21 0 top
CANL_2_C1  155.19,78.36 0 top
CANL_2_C2  96.9,94.36 0 top
CANL_2_C3  38.48,78.36 0 top
CANL_2_C4  80.9,37.21 0 top
CANL_3_C1  155.19,94.36 0 top
CANL_3_C3  38.61,94.36 0 top
CANL_3_C4  96.9,21.21 0 top
CANL_4_C1  139.32,94.36 0 top
CANL_4_C3  22.48,94.36 0 top
CANL_4_C4  96.9,37.21 0 top
CANL_C1  124.97,63.37 0 top
CANL_C2  114.94,63.37 0 top
CANL_C2_C3  63.25,61.72 0 top
CANL_C3  53.34,61.72 0 top
CN1  167.26,108.33 180 top
DINA  89.03,65.15 90 top
DN_C1  124.97,60.58 0 top
DN_C2  114.94,60.58 0 top
GND_1_C1  133.6,72.64 0 top
GND_1_C2  102.62,100.08 0 top
GND_1_C3  16.89,72.64 0 top
GND_1_C4  75.18,15.49 0 top
GND_2_C1  161.04,72.64 0 top
GND_2_C2  75.18,72.64 0 top
GND_2_C3  44.2,72.64 0 top
GND_2_C4  102.62,15.49 0 top
GND_3_C1  161.04,100.08 0 top
GND_3_C3  44.2,100.08 0 top
GND_3_C4  102.62,42.93 0 top
GND_4_C1  133.6,100.08 0 top
GND_4_C3  16.89,100.08 0 top
GND_4_C4  75.18,42.93 0 top
GND_C1  124.84,111.25 0 top
GND_C2  114.94,111.12 0 top
GND_C2_C3  63.25,111.12 0 top
GND_C3  53.21,111 0 top
J1  69.22,29.13 90 top
J3  10.36,87.12 90 top
L_C1_C3  111.89,76.45 0 top
L_C1_C4  66.29,73.53 0 top
L_C2  121.67,79.5 0 top
L_C2_C1  111.89,79.5 0 top
L_C2_C3  56.39,76.71 0 top
L_C2_C4  56.39,73.66 0 top
L_C3  121.67,76.45 0 top
L_C3_C2  66.29,76.71 0 top
L_C4  121.67,73.53 0 top
L_C4_C1  111.89,73.53 0 top
LED1  144.78,86.36 0 bottom
LED2  86.11,86.11 0 bottom
LED3  27.69,86.36 0 bottom
LED4  86.36,29.21 0 bottom
LED5  105.66,108.33 90 top
MECH_LINK_1  66.29,97.16 0 top
MECH_LINK_2  56.39,94.23 0 top
MECH_LINK_3  66.29,94.36 0 top
MECH_LINK_4  56.39,97.16 0 top
MECH_LINK_5  56.39,79.76 0 top
MECH_LINK_6  66.29,79.63 0 top
MECH_LINK_7  112.01,97.03 0 top
MECH_LINK_8  56.39,91.31 0 top
MECH_LINK_9  56.39,85.72 0 top
MECH_LINK_10  121.67,91.31 0 top
MECH_LINK_11  66.29,91.31 0 top
MECH_LINK_12  66.29,85.85 0 top
MECH_LINK_13  121.67,97.03 0 top
MECH_LINK_14  121.79,85.47 0 top
MECH_LINK_15  111.89,85.72 0 top
MECH_LINK_16  112.01,91.31 0 top
R1  171.07,99.31 270 top
R2  168.78,99.31 270 top
R3  166.5,99.31 270 top
R4  149.61,86.36 270 top
R5  88.72,86.11 90 top
R6  91.36,86.13 270 top
R7  30.43,86.26 90 top
R8  33.12,86.21 270 top
R9  88.95,29.21 90 top
R10  91.67,29.18 270 top
R12  147.32,86.49 90 top
R16  159.44,62.1 90 top
R17  162.94,62.08 90 top
R18  171.58,76.45 0 top
R19  144.78,86.49 270 top
R20  86.11,86.11 270 top
R21  27.76,86.23 270 top
R22  86.23,29.21 270 top
R23  105.66,110.62 0 top
S2_T_C2  121.67,94.11 0 top
S2_T_C2_C1  112.01,94.11 0 top
S3_T_C1_C3  66.29,88.39 0 top
S3_T_C3  121.67,88.39 0 top
S3_T_C3_C1  112.01,88.52 0 top
S3_T_C3_C2  56.39,88.52 0 top
S4_T_C1_C4  66.29,82.68 0 top
S4_T_C4  121.79,82.8 0 top
S4_T_C4_C1  111.89,82.8 0 top
S4_T_C4_C2  56.39,82.55 0 top
SJ1  147.19,65.53 180 top
SJ2  147.19,63.63 180 top
U1  167.13,88.14 0 top
U2  148.46,86.11 90 bottom
U3  89.87,86.33 90 bottom
U4  32.03,86.41 90 bottom
U5  90.65,29.16 90 bottom
U$1  169.93,66.67 180 top
VCC_1_C1  163.83,69.85 0 top
VCC_1_C2  72.39,69.72 0 top
VCC_1_C3  13.97,69.85 0 top
VCC_1_C4  72.39,12.57 0 top
VCC_2_C1  130.68,69.85 0 top
VCC_2_C2  105.54,102.87 0 top
VCC_2_C3  47.12,69.85 0 top
VCC_2_C4  105.54,12.57 0 top
VCC_3_C1  163.83,103 0 top
VCC_3_C3  47.12,102.74 0 top
VCC_3_C4  105.54,45.72 0 top
VCC_4_C1  130.68,103 0 top
VCC_4_C3  13.97,102.87 0 top
VCC_4_C4  72.39,45.72 0 top
VCC_C1  124.84,108.2 0 top
VCC_C2  114.94,108.2 0 top
VCC_C2_C3  63.25,108.2 0 top
VREG3V3  94.74,108.46 90 top

### Tracks (layer width: path | path; a pad name or v marks a point on that pad's centre or on a via)
3V3_C1  (via drill 0.6)
  Top 0.305: 168.86,103.81 CN1.VBUS 168.91,103.83 168.91,103.25 169.29,102.87 172.47,102.87 172.85,102.49 v172.85,100.58 | U$1.3 169.29,75.44 167.88,76.85 U1.26 167.88,87.76 | U1.50 170.38,92.13 | 170.38,92.13 170.69,91.82 172.76,91.82 U1.48 172.85,92.03 v172.85,95.12 | U1.56 167.38,92.08 167.77,91.69 | 167.77,91.69 169.95,91.69 170.38,92.13 | 167.88,87.76 167.88,91.58 167.77,91.69 | 167.88,87.76 167.01,86.89 U1.11 158.87,86.89 158.24,86.26 158.24,84.86 157.66,84.28 150.16,84.28 149.78,84.66 | 3V3_C1.TP v124.28,99.95 | v125.53,78.99 149.05,78.99 149.71,79.65 149.71,81.31 v149.78,81.38
  Top 0.61: v149.78,81.38 149.78,84.66 149.78,85.23 R4.2
  Bottom 0.305: v172.85,100.58 v172.85,95.12 | v124.28,99.95 124.28,80.24 v125.53,78.99
  Bottom 0.61: U2.1 147.56,82.13 148.34,81.36 149.76,81.36 v149.78,81.38
3V3_C2  (via drill 0.6)
  Top 0.61: C2.1 85.85,106.36 C1.1 82.28,106.38 C3.1 76.37,106.3 73.66,106.3 71.63,104.27 71.63,101.35 70.1,99.82 3V3_C2_C3.TP
  Top 0.813: v89.1,81.43 89.13,81.46 90.65,81.46 91.36,82.17 R6.2 91.48,85.06 v94.26,85.06 | 3V3_C2.TP 112.01,104.75 111.99,104.78 | 111.99,104.78 110.82,105.94 | 110.82,105.94 107.44,105.94 107.42,105.97 | LED5.A 106.6,108.22 106.6,106.78 107.42,105.97 | 94.26,95.38 92.79,96.85 87.33,96.85 85.95,98.22 85.95,101.24 85.98,101.27 C2.1 87.9,104.32 v91.92,104.32 | 94.26,95.38 v94.26,92.35 | VREG3V3.2 102.01,110.74 v102.06,110.69 | 107.42,105.97 110.8,105.97 110.82,105.94 | 111.99,104.78 111.99,99.87 111.86,99.75 98.63,99.75 94.26,95.38
  Bottom 0.813: v89.1,81.43 89.1,84.4 U3.1 | v94.26,92.35 v94.26,85.06 | v102.06,110.69 93.85,110.69 92.76,109.6 92.76,105.16 v91.92,104.32
3V3_C3  (via drill 0.6)
  Top 0.813: v33.1,81.94 33.1,85.23 R8.2 49.16,85.26 v49.2,85.22 | 3V3_C3.TP v49.51,99.82 36.78,99.82 35.31,101.3 35.31,105.49 v35.38,105.56 | v25.3,105.74 17.53,105.74 12.9,101.12 12.9,94.66 J3.1
  Bottom 0.813: U4.1 31.13,82.89 32.13,81.89 33.05,81.89 v33.1,81.94 | v35.38,105.56 25.48,105.56 v25.3,105.74 | v49.2,85.22 49.2,99.52 v49.51,99.82
3V3_C4  (via drill 0.6)
  Top 0.813: J1.1 79.94,36.63 81.31,38 81.31,47.9 82.73,49.33 93.34,49.33 94.64,48.03 94.64,29.18 93.65,28.19 | 93.65,28.19 91.71,28.19 R10.2 | v89.74,22.25 92.51,22.25 93.6,23.34 93.6,28.14 93.65,28.19
  Bottom 0.813: U5.1 89.75,22.27 v89.74,22.25
CAN_RX  (via drill 0.6)
  Top 0.305: U1.13 162.35,85.89 162.59,85.65 162.59,76.15 v162.23,75.79 | v164.47,72.44 166.95,72.44 168.07,71.35 168.07,69.8 U$1.4
  Bottom 0.305: v162.23,75.79 162.23,74.68 v164.47,72.44
CAN_TX  (via drill 0.6)
  Top 0.305: U1.14 160.47,85.39 160.07,84.99 160.07,84.3 161.29,83.08 161.29,78 160.81,77.52 160.81,75.06 159.79,74.04 155.83,74.04 154.91,73.13 154.91,68.73 156.03,67.61 159.89,67.61 v159.92,67.64 | v165.05,66.93 170.84,66.93 171.91,68 171.91,69.67 U$1.1
  Bottom 0.305: v159.92,67.64 162.25,67.64 162.99,66.9 165.02,66.9 v165.05,66.93
CANH  (via drill 0.6)
  Top 0.813: CANH_C1.TP 132.82,66.17 | 132.82,66.17 133.15,66.17 v133.21,66.23 | v133.21,66.23 136.93,69.95 145.34,69.95 147.45,72.06 147.45,74.4 v147.4,74.45 | SJ2.2 139.72,63.63 v139.7,63.6 | v133.21,66.23 132.88,66.23 132.82,66.17
  Bottom 0.406: CANH_3_C1.TP 158.37,97.28 158.37,97.16
  Bottom 0.813: 158.62,97.54 158.62,97.16 158.37,97.16 CANH_4_C1.TP 134.44,95.2 134.44,76.68 135.69,75.44 CANH_1_C1.TP | 158.62,75.56 CANH_2_C1.TP 158.09,75.59 156.79,75.59 155.65,74.45 v147.4,74.45 139.01,74.45 137.9,75.56 136.53,75.56 CANH_1_C1.TP | CANH_1_C1.TP 135.13,75.44 | v139.7,63.6 135.84,63.6 v133.21,66.23
CANH_C3  (via drill 0.6)
  Top 0.813: v19.05,86.87 18.8,87.12 J3.7 12.84,87.15 8.84,87.15 6.99,85.29 6.99,68.68 8.18,67.49 8.2,67.49 10.03,65.66 CANH_C3.TP
  Bottom 0.813: CANH_1_C3.TP 20.27,75.44 22.05,73.66 39.5,73.66 CANH_2_C3.TP 41.48,75.56 43.08,77.17 43.08,95.22 CANH_3_C3.TP 39.47,98.83 21.46,98.83 19.79,97.16 | CANH_4_C3.TP 19.79,97.16 | v19.05,86.87 19.05,96.42 19.79,97.16
CANH_C4  (via drill 0.6)
  Top 0.813: J1.7 74.85,29.13 v74.93,29.21
  Bottom 0.813: CANH_2_C4.TP 78.11,40.36 79.86,42.11 97.71,42.11 CANH_4_C4.TP 99.82,39.8 101.14,38.48 101.14,19.74 CANH_3_C4.TP 97.43,16.03 80.49,16.03 CANH_1_C4.TP 74.93,21.59 v74.93,29.21
CANL  (via drill 0.6)
  Top 0.305: 163.83,59.59 163.58,59.33 | R16.1 159.44,59.49 159.28,59.33
  Top 0.61: 169.22,60.27 169.22,63.52 U$1.6
  Top 0.813: CANL_C1.TP 132.89,63.37 136.83,67.31 150.52,67.31 | 150.52,67.31 152.71,67.31 154.66,65.38 154.66,60.81 156.16,59.33 159.28,59.33 163.58,59.33 168.28,59.33 169.22,60.27 | 150.52,67.31 152.55,69.34 152.55,74.55 153.19,75.18 157.53,75.18 159.41,77.06 159.41,78.99 v159.72,79.3
  Bottom 0.61: CANL_1_C1.TP 137.79,78.36 136.78,79.38 136.78,93.22 137.92,94.36 CANL_4_C1.TP 141.6,94.36 143.26,96.01 151.26,96.01 152.91,94.36 CANL_3_C1.TP
  Bottom 0.813: CANL_1_C1.TP 140.34,78.36 142.47,76.22 150.95,76.22 152.98,78.26 | 152.98,78.26 153.09,78.36 CANL_2_C1.TP | 152.98,78.26 156.79,78.26 157.84,79.3 v159.72,79.3
CANL_C3  (via drill 0.6)
  Top 0.813: v22.5,89.38 21.49,88.37 J3.6 8.48,88.37 5.41,85.29 5.41,67.97 11.66,61.72 CANL_C3.TP
  Bottom 0.813: CANL_3_C3.TP 38.99,94.36 39.12,94.23 | 39.12,94.23 38.73,94.23 CANL_3_C3.TP | 22.1,77.98 CANL_1_C3.TP 24.71,76.12 36.14,76.12 38.38,78.36 CANL_2_C3.TP 38.48,78.41 40.79,80.72 40.79,92.56 39.12,94.23 | CANL_3_C3.TP 36.22,96.75 24.59,96.75 22.48,94.64 CANL_4_C3.TP 22.5,94.34 v22.5,89.38
CANL_C4  (via drill 0.6)
  Top 0.813: J1.6 76.61,30.38 v76.66,30.43
  Bottom 0.813: 94.44,39.55 94.56,39.55 CANL_4_C4.TP | CANL_2_C4.TP 80.9,37.54 82.91,39.55 94.44,39.55 | 94.44,39.55 98.93,35.05 98.93,23.24 CANL_3_C4.TP 93.93,18.24 83.62,18.24 80.9,20.95 CANL_1_C4.TP 80.72,21.39 78.56,21.39 76.66,23.29 v76.66,30.43
CTANK
  Top 0.305: C5.1 172.53,83.25 171.96,83.82 170.18,83.82 169.93,83.57 169.93,82.48 U1.30
GND3  (via drill 0.6)
  Top 0.813: GND_C3.TP 32.33,111 30.3,108.97 30.3,101.4 v30.5,101.19 32.64,99.06 32.64,94.13 30.63,92.12 J3.3 | R7.1 27.79,85.31 R21.2 | R7.1 30.43,80.7 31.11,80.01 44.98,80.01 v45.16,79.83 | R7.1 30.43,81.05 31.11,80.37 31.65,80.37 32.03,79.98 34.57,79.98 34.75,80.16 34.75,80.59 36.37,82.22 v36.37,83.11
  Bottom 0.813: GND_4_C3.TP 16.38,100.08 16.26,100.2 16.76,100.2 GND_4_C3.TP | GND_1_C3.TP 17.73,72.64 18.9,71.48 43.03,71.48 GND_2_C3.TP 45.16,73.61 v45.16,79.83 45.16,98.68 44.2,99.64 GND_3_C3.TP 43.08,101.19 v30.5,101.19 18.29,101.19 17.17,100.08 GND_4_C3.TP | U4.4 32.93,84.04 33.73,83.24 36.25,83.24 v36.37,83.11
  pour Bottom (isolate 1.016): 2.79,58.8 54.86,58.8 54.86,69.09 57.91,69.09 57.91,103.63 54.61,103.63 54.61,113.92 2.79,113.92
  pour Top (isolate 1.016): 2.79,58.8 54.86,58.8 54.86,69.09 57.91,69.09 57.91,103.63 54.61,103.63 54.61,113.92 2.79,113.92
GND4  (via drill 0.6)
  Top 0.813: v91.57,24.31 91.44,24.43 89.84,24.43 88.95,25.32 R9.1 R22.2 84.09,28.26 v84.05,28.22 | J1.3 83.44,34.13 85.78,36.47 85.78,44.48 v85.42,44.83 | v84.05,23.44 84.05,13.51 v84,13.46
  Bottom 0.813: GND_4_C4.TP 75.74,42.93 77.65,44.83 v85.42,44.83 100.91,44.83 102.76,42.99 | 102.76,42.99 103.07,42.67 103.07,15.39 102.78,15.1 | 102.78,15.1 101.14,13.46 v84,13.46 77.22,13.46 GND_1_C4.TP | v91.57,24.31 91.57,27.34 U5.4 | v84.05,28.22 v84.05,23.44 | GND_2_C4.TP 102.62,15.27 102.78,15.1 | GND_3_C4.TP 102.69,42.93 102.76,42.99
  pour Bottom (isolate 1.27): 61.72,56.52 116.46,56.52 116.46,1.52 61.59,1.52 61.59,56.52
  pour Top (isolate 1.27): 61.85,56.52 116.59,56.52 116.59,1.52 61.72,1.52 61.72,56.52
GND_C1  (via drill 0.6)
  Top 0.305: 161.29,65.6 C6.2 161.42,65.72 161.42,72.26 161.06,72.62 | CN1.D- 168.06,107.53 v168.02,107.57 | 138.68,100.2 v138.56,100.08 | C5.2 170.63,80.71 v170.69,80.77 | C4.2 170.69,73.98 v170.69,72.01 170.56,71.88 U$1.2 170.56,71.83 v170.71,71.98 | U1.49 170.88,94.8 170.56,95.12 167.13,95.12 | 166.88,94.87 U1.57 | U1.57 166.88,88.27 166,87.39 U1.10 158.48,87.39 157.43,86.33 157.43,85.34 156.9,84.81 153.37,84.81 v152.48,85.7 | U1.57 166.88,94.87 | 166.88,94.87 167.13,95.12 | 167.13,95.12 165.35,95.12 164.72,95.76 164.72,99.57 164.21,100.08 v158.12,100.08 | 161.34,72.9 161.06,72.62 | 162.93,63.04 R17.2 162.9,63.07 161.98,63.07 161.24,63.8 161.24,65.55 | U1.17 163.4,82.44 163.4,76.12 | 163.4,76.12 163.4,75.01 GND_2_C1.TP | 161.06,72.62 GND_2_C1.TP | GND_2_C1.TP 157.84,72.64 v157.81,72.62 | v166.85,75.06 164.47,75.06 163.4,76.12
  Top 0.61: R12.1 R19.2 144.75,85.51 v144.75,80.54
  Top 0.813: v158.12,107.57 v158.12,100.08 | GND_C1.TP 136.4,111.25 138.68,108.97 138.68,100.2 | 161.24,65.55 C6.2
  Bottom 0.305: v170.69,80.77 v170.69,72.01 | v152.48,85.7 152.29,85.7 150.9,84.31 | 159.08,72.62 159.03,72.67 158.95,72.67 158.9,72.62 v157.81,72.62 157.84,72.64 GND_2_C1.TP | v170.71,71.98 169.04,71.98 168.12,72.9 168.12,73.79 v166.85,75.06
  Bottom 0.61: 133.22,99.69 GND_4_C1.TP | U2.4 150.9,84.31 151.13,84.31 151.64,83.8 151.64,80.54 150.98,79.88 145.41,79.88 v144.75,80.54
  Bottom 0.813: GND_2_C1.TP GND_1_C1.TP 133.32,72.64 132.28,73.69 132.28,98.75 GND_4_C1.TP v138.56,100.08 v158.12,100.08 GND_3_C1.TP | v168.02,107.57 v158.12,107.57
  pour Top (isolate 1.27): 123.06,58.42 174.88,58.42 174.88,113.79 122.94,113.79 122.94,103.63 119.89,103.63 119.89,69.22 122.94,69.22 122.94,58.42
  pour Bottom (isolate 1.27): 123.06,58.29 174.88,58.29 174.88,113.67 122.94,113.67 122.94,103.5 119.89,103.5 119.89,69.09 122.94,69.09 122.94,58.29
GND_C2  (via drill 0.6)
  Top 0.61: 115.32,110.74 GND_C2.TP 114.55,111.51 v111.89,111.51 111.76,111.38 111.76,110.87 111.51,110.62 R23.2 106.55,110.68 106.55,111.89 105.92,112.52 94.49,112.52 90.3,108.33 82.68,108.33 | GND_C2_C3.TP 75.61,111.12 C3.2 76.5,110.24 78.61,110.24 80.52,108.33 82.68,108.33 | 82.68,108.33 82.61,108.27 C1.2 82.42,108.14 C2.2 91.92,108.14 VREG3V3.3
  Top 0.813: R5.1 R20.2 86.28,84.98 86.28,80.8 87.27,79.81 | v92.63,81.08 92.63,80.72 91.72,79.81 87.27,79.81 | 87.27,79.81 87.1,79.81 86.08,80.82 86.08,85.11 86.13,85.17 83.19,85.17 82.14,84.12 78.59,84.12 77.19,85.52 77.19,89.64 75.26,91.57 v73.94,91.57
  Bottom 0.61: GND_1_C2.TP 110.24,100.08 111.76,101.6 111.76,111.38 v111.89,111.51
  Bottom 0.813: GND_2_C2.TP 75.18,72.92 | 75.18,72.92 73.94,74.17 v73.94,91.57 73.94,94.94 79.76,100.76 101.93,100.76 GND_1_C2.TP | U3.4 90.77,82.94 v92.63,81.08 | 75.18,72.92 88.19,72.92 88.98,72.14 | 88.98,72.14 89,72.11 89,67.72 DINA.3 | 88.98,72.14 88.98,67.87 89.08,67.77
  pour Bottom (isolate 1.27): 61.34,113.79 61.34,103.38 64.52,103.38 64.52,68.96 61.21,68.96 61.21,58.42 116.46,58.42 116.46,68.83 113.41,68.83 113.41,103.63 116.46,103.63 116.46,114.05 61.34,114.05
  pour Top (isolate 1.27): 61.34,113.79 61.34,103.38 64.52,103.38 64.52,68.96 61.21,68.96 61.21,58.42 116.46,58.42 116.46,68.83 113.41,68.83 113.41,103.63 116.46,103.63 116.46,114.05 61.34,114.05
LED_S1  (via drill 0.6)
  Top 0.305: U1.2 160.38,91.39 159.97,91.8 159.97,94.28 159.13,95.12 157.63,95.12 156.41,96.34 156.41,108.13 155.52,109.02 142.11,109.02 141.12,108.03 141.12,99.26 140.34,98.48 126.59,98.48 v126.54,98.58 | v126.57,81.23 140.84,81.23 v142.06,82.45
  Bottom 0.305: v126.54,98.58 126.54,81.28 v126.57,81.23 | v142.06,82.45 142.06,82.59 LED1.A
LED_S2  (via drill 0.6)
  Top 0.305: L_C2.TP 122.99,79.5 124.92,77.57 155.37,77.57 156.74,78.94 156.74,82.86 157.28,83.39 159.31,83.39 v159.36,83.34 | v158.06,92.66 158.65,92.66 159.31,92 159.31,91.16 159.56,90.91 161.41,90.91 U1.3
  Bottom 0.305: v159.36,83.34 159.36,92.02 158.7,92.69 158.24,92.69 v158.06,92.66
LED_S2_C2  (via drill 0.6)
  Top 0.813: L_C2_C1.TP 108.51,79.5 v108.48,79.53
  Bottom 0.813: v108.48,79.53 87.07,79.53 86.06,80.54 86.06,85 LED2.A
LED_S3  (via drill 0.6)
  Top 0.305: U1.4 158.68,90.39 v158.12,90.96 | v158.14,81.69 158.14,78.05 156.57,76.48 121.69,76.48 L_C3.TP
  Bottom 0.305: v158.12,90.96 158.12,81.71 v158.14,81.69
LED_S3_C3  (via drill 0.6)
  Top 0.813: v27.71,78.51 27.71,77.37 28.42,76.66 56.34,76.66 L_C2_C3.TP
  Bottom 0.813: LED3.A 27.69,78.54 v27.71,78.51
LED_S4  (via drill 0.6)
  Top 0.305: L_C4.TP 127.61,73.53 v127.81,73.74 | v154.91,106.32 154.91,92.38 157.43,89.86 161.41,89.86 U1.5
  Bottom 0.305: v127.81,73.74 127.81,104.8 129.34,106.32 v154.91,106.32
LED_S4_C4  (via drill 0.6)
  Top 0.813: J1.5 78.2,31.63 78.77,31.06 78.77,26.59 79.5,25.86 v86.13,25.86
  Bottom 0.813: v86.13,25.86 86.13,27.93 LED4.A
LED_T_S4  (via drill 0.6)
  Top 0.813: J3.5 16.57,89.62 v16.61,89.66 | v16.59,77.67 16.59,76.05 19.46,73.18 55.91,73.18 L_C2_C4.TP
  Bottom 0.813: v16.61,89.66 16.61,77.7 v16.59,77.67
MOTOR  (via drill 0.6)
  Top 0.305: U1.62 164.34,93.88 163.93,93.88 U1.63 163.88,96.21 v163.58,96.52 | v152.65,60.83 152.65,64.77 151.89,65.53 SJ1.1
  Bottom 0.305: v163.58,96.52 163.58,98.68 164.72,99.82 168.02,99.82 168.78,100.58 168.78,102.23 169.42,102.87 173.48,102.87 173.99,102.36 173.99,60.58 172.85,59.44 154.05,59.44 v152.65,60.83
N$1
  Top 0.305: CN1.D+ 167.26,102.36 167.51,102.11 170.69,102.11 171.07,101.73 R1.1
N$2
  Top 0.305: CN1.ID 166.46,101.77 166.75,101.47 168.66,101.47 168.91,101.22 168.91,100.39 R2.1
N$3
  Top 0.305: R3.1 165.61,100.97 165.61,103.83 CN1.GND
N$5  (via drill 0.6)
  Top 0.305: SJ2.1 149.48,61.8 v149.5,61.77 | v156.67,63.14 159.34,63.14 R16.2 | U$1.7 170.56,65 170.41,65.15 165.74,65.15 165.15,64.57 165.15,63.04 v165.18,63.02
  Bottom 0.305: v149.5,61.77 149.5,62.51 150.09,63.09 156.62,63.09 v156.67,63.14 156.79,63.02 v165.18,63.02
N$6  (via drill 0.6)
  Top 0.813: R5.2 v88.72,90.65
  Bottom 0.813: v88.72,90.65 88.72,88.38 U3.2
N$7  (via drill 0.6)
  Top 0.61: CANH_C2_C3.TP 63.75,65.66 68.71,60.71 103.89,60.71 v109.22,66.04 CANH_C2.TP
  Bottom 0.61: CANH_2_C2.TP 96.77,97.28 95.63,98.42 81.15,98.42 76.71,93.98 76.71,78.49 78.11,77.09 CANH_1_C2.TP 97.28,75.44 98.3,74.42 98.3,69.34 99.69,67.94 108.46,67.94 109.22,67.18 v109.22,66.04
N$8  (via drill 0.6)
  Top 0.813: R7.2 30.43,88.54 29.59,89.38 v25.4,89.38
  Bottom 0.813: v25.4,89.38 29.96,89.38 U4.2
N$9  (via drill 0.6)
  Top 0.305: U$1.8 171.83,61.01 v171.86,60.98 | v165.3,61.06 163.01,61.06 R17.1
  Bottom 0.305: v171.86,60.98 165.38,60.98 v165.3,61.06
N$10  (via drill 0.6)
  Top 0.813: R9.2 88.95,33.22 v88.98,33.3
  Bottom 0.813: v88.98,33.3 88.98,31.74 U5.2
N$11
  Top 0.61: R18.2 C4.1
N$12
  pour Bottom (isolate 1.27): 122.94,58.29 174.75,58.29 174.75,113.67 122.81,113.67 122.81,103.5 119.76,103.5 119.76,69.09 122.81,69.09 122.81,58.29
N$13
  Top 0.813: DN_C1.TP 133.76,60.58 138.71,65.53 SJ1.2
N$14  (via drill 0.6)
  Top 0.813: R19.1 LED1.C 142.51,87.41 v142.49,87.43
  Bottom 0.813: v142.49,87.43 144.76,87.43 LED1.C
N$15  (via drill 0.6)
  Top 0.813: R20.1 v84.06,87.06 v84.05,87.05
  Bottom 0.813: v84.05,87.05 86,87.05 LED2.C
N$16  (via drill 0.6)
  Top 0.813: R21.1 25.57,87.18 v25.55,87.2
  Bottom 0.813: v25.55,87.2 27.47,87.2 LED3.C
N$17  (via drill 0.6)
  Top 0.813: R22.1 84.06,30.16 v84.02,30.12
  Bottom 0.813: v84.02,30.12 86.22,30.12 LED4.C
N$18
  Top 0.406: R23.1 104.61,110.62 LED5.C
N$19  (via drill 0.6)
  Top 0.61: v110.74,60.58 DN_C2.TP
  Bottom 0.61: DINA.1 93.47,62.61 95.5,60.58 v110.74,60.58
N$20
  Top 0.61: 111.76,73.66 L_C4_C1.TP 109.86,73.53 109.09,72.77 109.09,70.1 108.46,69.47 70.61,69.47 69.85,70.23 69.85,72.9 69.22,73.53 L_C1_C4.TP
N$21  (via drill 0.6)
  Top 0.61: R12.2 v147.32,89.97
  Bottom 0.61: v147.32,89.97 147.32,88.15 U2.2
N$22
  Top 0.61: L_C3_C2.TP 69.34,76.71 70.87,75.18 70.87,71.12 71.5,70.48 107.44,70.48 108.08,71.12 108.08,75.31 109.22,76.45 L_C1_C3.TP
N$26
  Top 0.61: S3_T_C1_C3.TP 73.15,88.39 74.42,87.12 74.42,74.42 75.18,73.66 102.87,73.66 103.5,74.3 103.5,85.72 106.3,88.52 S3_T_C3_C1.TP
N$27
  Top 0.61: S4_T_C1_C4.TP 70.74,82.68 72.01,81.41 72.01,72.14 72.64,71.5 105.03,71.5 105.92,72.39 105.92,81.41 107.31,82.8 S4_T_C4_C1.TP
N$29  (via drill 0.6)
  Top 0.813: VCC_C1.TP 135.13,108.2 136.27,107.06 v136.27,103
  Bottom 0.406: 130.3,102.74 131.7,102.74 131.7,103
  Bottom 0.61: 130.56,69.85 VCC_2_C1.TP VCC_4_C1.TP | 130.68,102.36 130.3,102.74
  Bottom 0.813: VCC_4_C1.TP 131.7,103 v136.27,103 VCC_3_C1.TP | VCC_2_C1.TP VCC_1_C1.TP
N$32  (via drill 0.6)
  Top 0.61: CANL_C2_C3.TP 65.28,61.72 67.82,59.18 104.65,59.18 108.84,63.37 v110.74,63.37 CANL_C2.TP
  Bottom 0.61: CANL_1_C2.TP 80.77,78.49 80.77,78.61 78.87,80.52 78.87,92.84 82.55,96.52 92.71,96.52 94.87,94.36 CANL_2_C2.TP | 99.69,70.23 100.58,69.34 109.86,69.34 110.74,68.45 v110.74,63.37
  Bottom 0.813: CANL_1_C2.TP 81.81,78.36 83.39,76.78 98.32,76.78 99.72,75.39 99.72,70.26 99.69,70.23
S1_T  (via drill 0.6)
  Top 0.305: U1.6 156.15,89.39 v155.17,90.37
  Top 0.61: R4.1 149.61,89.94 v149.56,89.97
  Bottom 0.305: v155.17,90.37 150.01,90.37 | v149.56,89.97 149.33,89.66 149.33,87.94 U2.3
  Bottom 0.406: v149.56,89.97 150.01,90.37
S2_T
  Top 0.305: S2_T_C2.TP 126.64,94.08 130,97.56 152.17,97.56 153.26,96.47 153.26,96.44 153.72,95.99 153.72,89.94 154.79,88.88 161.42,88.88 U1.7 161.37,88.82
S2_T_C2  (via drill 0.6)
  Top 0.813: R6.1 v91.36,90.63 91.52,90.47 100.97,90.47 104.6,94.11 S2_T_C2_C1.TP
  Bottom 0.813: v91.36,90.63 91.36,88.73 U3.3
S3_T
  Top 0.305: S3_T_C3.TP 126.54,88.39 127.69,89.53 127.69,93.65 130.45,96.67 151.1,96.67 152.55,95.22 152.55,89.38 153.62,88.32 161.36,88.32 U1.8 161.38,88.34
S3_T_C3  (via drill 0.6)
  Top 0.813: R8.1 35.27,87.16 v35.28,87.17 | S3_T_C3_C2.TP 47.93,88.52 42.22,94.23 35.36,94.23 v35.26,94.13
  Bottom 0.813: U4.3 33.97,87.17 v35.28,87.17 35.26,87.2 v35.26,94.13
S4_J_C4  (via drill 0.6)
  Top 0.813: R10.1 91.67,33.33 v91.72,33.38 91.77,33.43 91.77,34.42 90.83,35.36 87.27,35.36 87.05,35.13 87.02,35.13 84.78,32.88 J1.4
  Bottom 0.813: v91.72,33.38 91.72,30.4 | 91.72,30.4 91.44,30.12 | 91.72,30.4 91.72,30.38 91.47,30.12 91.47,30.2 91.69,30.43 91.69,30.82 U5.3
S4_T
  Top 0.305: S4_T_C4.TP 127.13,82.8 128.85,84.53 128.85,93.32 131.04,95.86 150.62,95.86 151.46,95.02 151.46,88.88 152.45,87.88 U1.9
S4_T_C4
  Top 0.813: J3.4 40.89,90.87 | 40.89,90.87 41.18,90.87 | S4_T_C4_C2.TP 53.11,82.55 51.38,84.28 51.38,86.31 50.44,87.25 47.47,87.25 43.87,90.86 40.91,90.86 40.89,90.87
SAR_BY  (via drill 0.6)
  Top 0.406: C6.1 158.21,65.67 v157.66,66.17 | v161.44,93.78 161.44,91.9 U1.1
  Bottom 0.406: v157.66,66.17 159.46,66.14 160.17,65.43 165.56,65.43 166.6,66.47 166.6,72.49 165.3,73.79 164.44,73.79 163.88,74.35 163.88,92.94 163.09,93.73 161.49,93.73 v161.44,93.78
SHUNT
  Top 0.305: R18.1 169.67,76.45 169.42,76.71 169.42,82.4 U1.29
SWDCLK  (via drill 0.6)
  Top 0.305: U1.21 165.38,80.62 v166.5,79.5 | v168.78,96.39 R2.2
  Bottom 0.305: v166.5,79.5 167.13,79.5 167.64,80.01 167.64,83.44 168.28,84.07 170.31,84.07 171.2,84.96 171.2,95.5 170.31,96.39 v168.78,96.39
SWDIO  (via drill 0.6)
  Top 0.305: U1.20 164.88,78.7 165.61,77.98 v166.5,77.98 | v166.24,96.52 166.24,98.11 R3.2
  Bottom 0.305: v166.5,77.98 167.77,77.98 168.4,78.61 168.4,82.93 168.78,83.31 170.81,83.31 171.96,84.45 171.96,97.54 171.2,98.3 166.62,98.3 166.24,97.92 v166.24,96.52
VCC_C2  (via drill 0.6)
  Top 0.61: v109.6,108.2 VCC_C2.TP | VCC_C2_C3.TP v72.01,108.2 | VREG3V3.1 v102.36,106.18 v102.36,106.17
  Bottom 0.61: VCC_2_C2.TP 77.09,102.87 72.01,97.79 | 72.01,97.79 72.01,70.1 VCC_1_C2.TP 83.57,69.72 85.34,67.94 85.34,66.17 86.36,65.15 DINA.2 | VCC_2_C2.TP 108.33,102.74 109.6,104.01 v109.6,108.2 | v72.01,108.2 72.01,97.79 | v102.36,106.17 102.36,106.05 VCC_2_C2.TP
VCC_C3  (via drill 0.6)
  Top 0.813: J3.2 25.83,93.37 27.79,95.33 27.79,102.67 v27.99,102.87
  Bottom 0.813: VCC_1_C3.TP VCC_2_C3.TP VCC_3_C3.TP 46.99,102.87 v27.99,102.87 VCC_4_C3.TP
VCC_C4  (via drill 0.6)
  Top 0.813: J1.2 77.57,35.38 77.6,35.41 81.94,35.41 83.67,37.13 83.67,47.3 v83.57,47.4
  Bottom 0.813: VCC_4_C4.TP 72.69,45.72 74.37,47.4 v83.57,47.4 103.86,47.4 VCC_3_C4.TP VCC_2_C4.TP 103.23,10.26 74.57,10.26 72.39,12.45 VCC_1_C4.TP
XRES
  Top 0.305: U1.47 173.81,91.39 174.12,91.69 174.12,98.04 173.74,98.42 171.13,98.42 R1.2